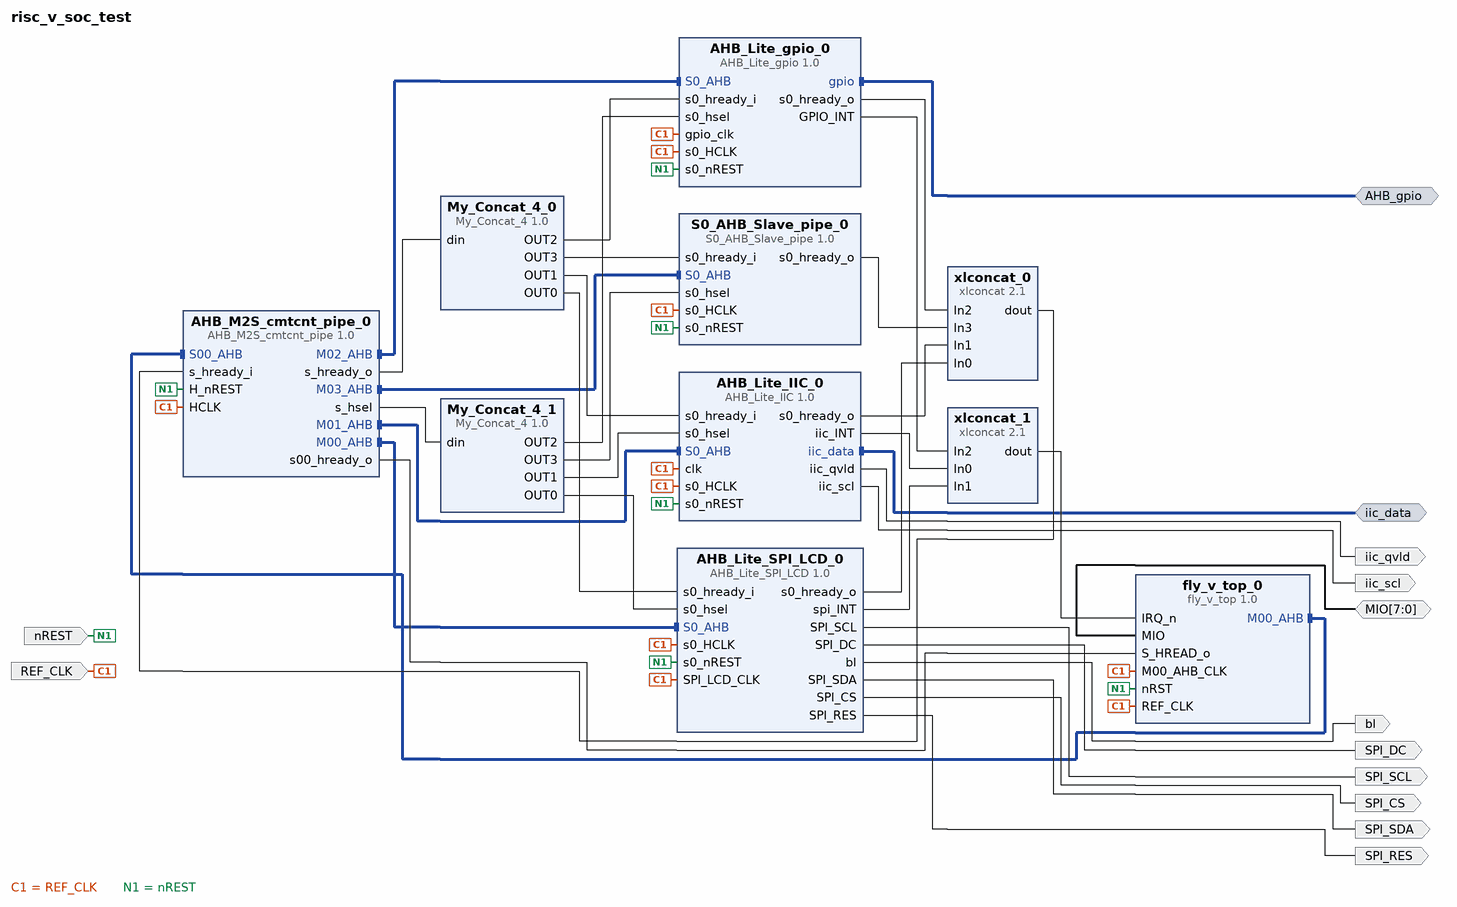
[diagram p0: block diagram of the top level]
# Vivado block design risc_v_soc_test, xc7z010clg400-1, Vivado 2018.3
create_bd_design risc_v_soc_test

create_bd_intf_port -mode Master -vlnv xilinx.com:interface:gpio_rtl:1.0 AHB_gpio
create_bd_intf_port -mode Master -vlnv xilinx.com:interface:gpio_rtl:1.0 iic_data
create_bd_port -dir I -type clk REF_CLK
create_bd_port -dir O iic_scl
create_bd_port -dir O iic_qvld
create_bd_port -dir O SPI_SCL
create_bd_port -dir O SPI_SDA
create_bd_port -dir O SPI_DC
create_bd_port -dir O SPI_RES
create_bd_port -dir O SPI_CS
create_bd_port -dir O bl
create_bd_port -dir IO -from 7 -to 0 MIO
create_bd_port -dir I nREST

create_bd_cell -type ip -vlnv xilinx.com:user:AHB_Lite_gpio:1.0 AHB_Lite_gpio_0
create_bd_cell -type ip -vlnv xilinx.com:user:AHB_Lite_IIC:1.0 AHB_Lite_IIC_0
create_bd_cell -type ip -vlnv xilinx.com:user:AHB_Lite_SPI_LCD:1.0 AHB_Lite_SPI_LCD_0
create_bd_cell -type ip -vlnv xilinx.com:user:AHB_M2S_cmtcnt_pipe:1.0 AHB_M2S_cmtcnt_pipe_0
create_bd_cell -type ip -vlnv xilinx.com:user:S0_AHB_Slave_pipe:1.0 S0_AHB_Slave_pipe_0
create_bd_cell -type ip -vlnv xilinx.com:user:My_Concat_4:1.0 My_Concat_4_0
create_bd_cell -type ip -vlnv xilinx.com:user:My_Concat_4:1.0 My_Concat_4_1
create_bd_cell -type ip -vlnv xilinx.com:ip:xlconcat:2.1 xlconcat_0
set_property -dict {CONFIG.NUM_PORTS 4} [get_bd_cells xlconcat_0]
create_bd_cell -type ip -vlnv xilinx.com:ip:xlconcat:2.1 xlconcat_1
set_property -dict {CONFIG.NUM_PORTS 3} [get_bd_cells xlconcat_1]
create_bd_cell -type ip -vlnv xilinx.com:user:fly_v_top:1.0 fly_v_top_0
set_property -dict {CONFIG.MIO_WIDTH 8 CONFIG.USER_EXT_IRQ_NUM 3} [get_bd_cells fly_v_top_0]

# ---- connections ----

connect_bd_intf_net [get_bd_intf_pins AHB_Lite_SPI_LCD_0/S0_AHB] [get_bd_intf_pins AHB_M2S_cmtcnt_pipe_0/M00_AHB]
connect_bd_intf_net [get_bd_intf_pins fly_v_top_0/M00_AHB] [get_bd_intf_pins AHB_M2S_cmtcnt_pipe_0/S00_AHB]
connect_bd_intf_net [get_bd_intf_ports AHB_gpio] [get_bd_intf_pins AHB_Lite_gpio_0/gpio]
connect_bd_intf_net [get_bd_intf_pins AHB_Lite_gpio_0/S0_AHB] [get_bd_intf_pins AHB_M2S_cmtcnt_pipe_0/M02_AHB]
connect_bd_intf_net [get_bd_intf_ports iic_data] [get_bd_intf_pins AHB_Lite_IIC_0/iic_data]
connect_bd_intf_net [get_bd_intf_pins AHB_Lite_IIC_0/S0_AHB] [get_bd_intf_pins AHB_M2S_cmtcnt_pipe_0/M01_AHB]
connect_bd_intf_net [get_bd_intf_pins S0_AHB_Slave_pipe_0/S0_AHB] [get_bd_intf_pins AHB_M2S_cmtcnt_pipe_0/M03_AHB]
connect_bd_net [get_bd_ports REF_CLK] \
  [get_bd_pins AHB_M2S_cmtcnt_pipe_0/HCLK] [get_bd_pins AHB_Lite_SPI_LCD_0/s0_HCLK] [get_bd_pins S0_AHB_Slave_pipe_0/s0_HCLK] \
  [get_bd_pins AHB_Lite_IIC_0/clk] [get_bd_pins AHB_Lite_IIC_0/s0_HCLK] [get_bd_pins AHB_Lite_gpio_0/gpio_clk] \
  [get_bd_pins AHB_Lite_gpio_0/s0_HCLK] [get_bd_pins AHB_Lite_SPI_LCD_0/SPI_LCD_CLK] [get_bd_pins fly_v_top_0/REF_CLK] \
  [get_bd_pins fly_v_top_0/M00_AHB_CLK]
connect_bd_net [get_bd_ports nREST] \
  [get_bd_pins AHB_Lite_SPI_LCD_0/s0_nREST] [get_bd_pins AHB_M2S_cmtcnt_pipe_0/H_nREST] \
  [get_bd_pins S0_AHB_Slave_pipe_0/s0_nREST] [get_bd_pins AHB_Lite_gpio_0/s0_nREST] [get_bd_pins AHB_Lite_IIC_0/s0_nREST] \
  [get_bd_pins fly_v_top_0/nRST]
connect_bd_net [get_bd_pins AHB_M2S_cmtcnt_pipe_0/s_hsel] [get_bd_pins My_Concat_4_1/din]
connect_bd_net [get_bd_pins My_Concat_4_0/OUT0] [get_bd_pins AHB_Lite_SPI_LCD_0/s0_hready_i]
connect_bd_net [get_bd_pins My_Concat_4_1/OUT0] [get_bd_pins AHB_Lite_SPI_LCD_0/s0_hsel]
connect_bd_net [get_bd_pins AHB_Lite_SPI_LCD_0/s0_hready_o] [get_bd_pins xlconcat_0/In0]
connect_bd_net [get_bd_pins xlconcat_0/dout] [get_bd_pins AHB_M2S_cmtcnt_pipe_0/s_hready_i]
connect_bd_net [get_bd_pins AHB_Lite_IIC_0/s0_hready_o] [get_bd_pins xlconcat_0/In1]
connect_bd_net [get_bd_pins My_Concat_4_1/OUT1] [get_bd_pins AHB_Lite_IIC_0/s0_hsel]
connect_bd_net [get_bd_pins My_Concat_4_0/OUT1] [get_bd_pins AHB_Lite_IIC_0/s0_hready_i]
connect_bd_net [get_bd_pins My_Concat_4_1/OUT2] [get_bd_pins AHB_Lite_gpio_0/s0_hsel]
connect_bd_net [get_bd_pins My_Concat_4_0/OUT2] [get_bd_pins AHB_Lite_gpio_0/s0_hready_i]
connect_bd_net [get_bd_pins AHB_Lite_gpio_0/s0_hready_o] [get_bd_pins xlconcat_0/In2]
connect_bd_net [get_bd_pins S0_AHB_Slave_pipe_0/s0_hready_o] [get_bd_pins xlconcat_0/In3]
connect_bd_net [get_bd_pins My_Concat_4_0/OUT3] [get_bd_pins S0_AHB_Slave_pipe_0/s0_hready_i]
connect_bd_net [get_bd_pins My_Concat_4_1/OUT3] [get_bd_pins S0_AHB_Slave_pipe_0/s0_hsel]
connect_bd_net [get_bd_pins AHB_M2S_cmtcnt_pipe_0/s_hready_o] [get_bd_pins My_Concat_4_0/din]
connect_bd_net [get_bd_pins AHB_M2S_cmtcnt_pipe_0/s00_hready_o] [get_bd_pins fly_v_top_0/S_HREAD_o]
connect_bd_net [get_bd_pins AHB_Lite_IIC_0/iic_scl] [get_bd_ports iic_scl]
connect_bd_net [get_bd_pins AHB_Lite_IIC_0/iic_qvld] [get_bd_ports iic_qvld]
connect_bd_net [get_bd_pins AHB_Lite_SPI_LCD_0/SPI_SCL] [get_bd_ports SPI_SCL]
connect_bd_net [get_bd_pins AHB_Lite_SPI_LCD_0/SPI_SDA] [get_bd_ports SPI_SDA]
connect_bd_net [get_bd_pins AHB_Lite_SPI_LCD_0/SPI_DC] [get_bd_ports SPI_DC]
connect_bd_net [get_bd_pins AHB_Lite_SPI_LCD_0/SPI_RES] [get_bd_ports SPI_RES]
connect_bd_net [get_bd_pins AHB_Lite_SPI_LCD_0/SPI_CS] [get_bd_ports SPI_CS]
connect_bd_net [get_bd_pins AHB_Lite_SPI_LCD_0/bl] [get_bd_ports bl]
connect_bd_net [get_bd_pins AHB_Lite_IIC_0/iic_INT] [get_bd_pins xlconcat_1/In0]
connect_bd_net [get_bd_pins AHB_Lite_SPI_LCD_0/spi_INT] [get_bd_pins xlconcat_1/In1]
connect_bd_net [get_bd_pins AHB_Lite_gpio_0/GPIO_INT] [get_bd_pins xlconcat_1/In2]
connect_bd_net [get_bd_pins xlconcat_1/dout] [get_bd_pins fly_v_top_0/IRQ_n]
connect_bd_net [get_bd_ports MIO] [get_bd_pins fly_v_top_0/MIO]

validate_bd_design
save_bd_design
